# Altium schematic sheet cover.SchDoc: Cover
size A4; Organization: GPA Robotics; DocumentNumber: 1; SheetNumber: 1; SheetTotal: 4
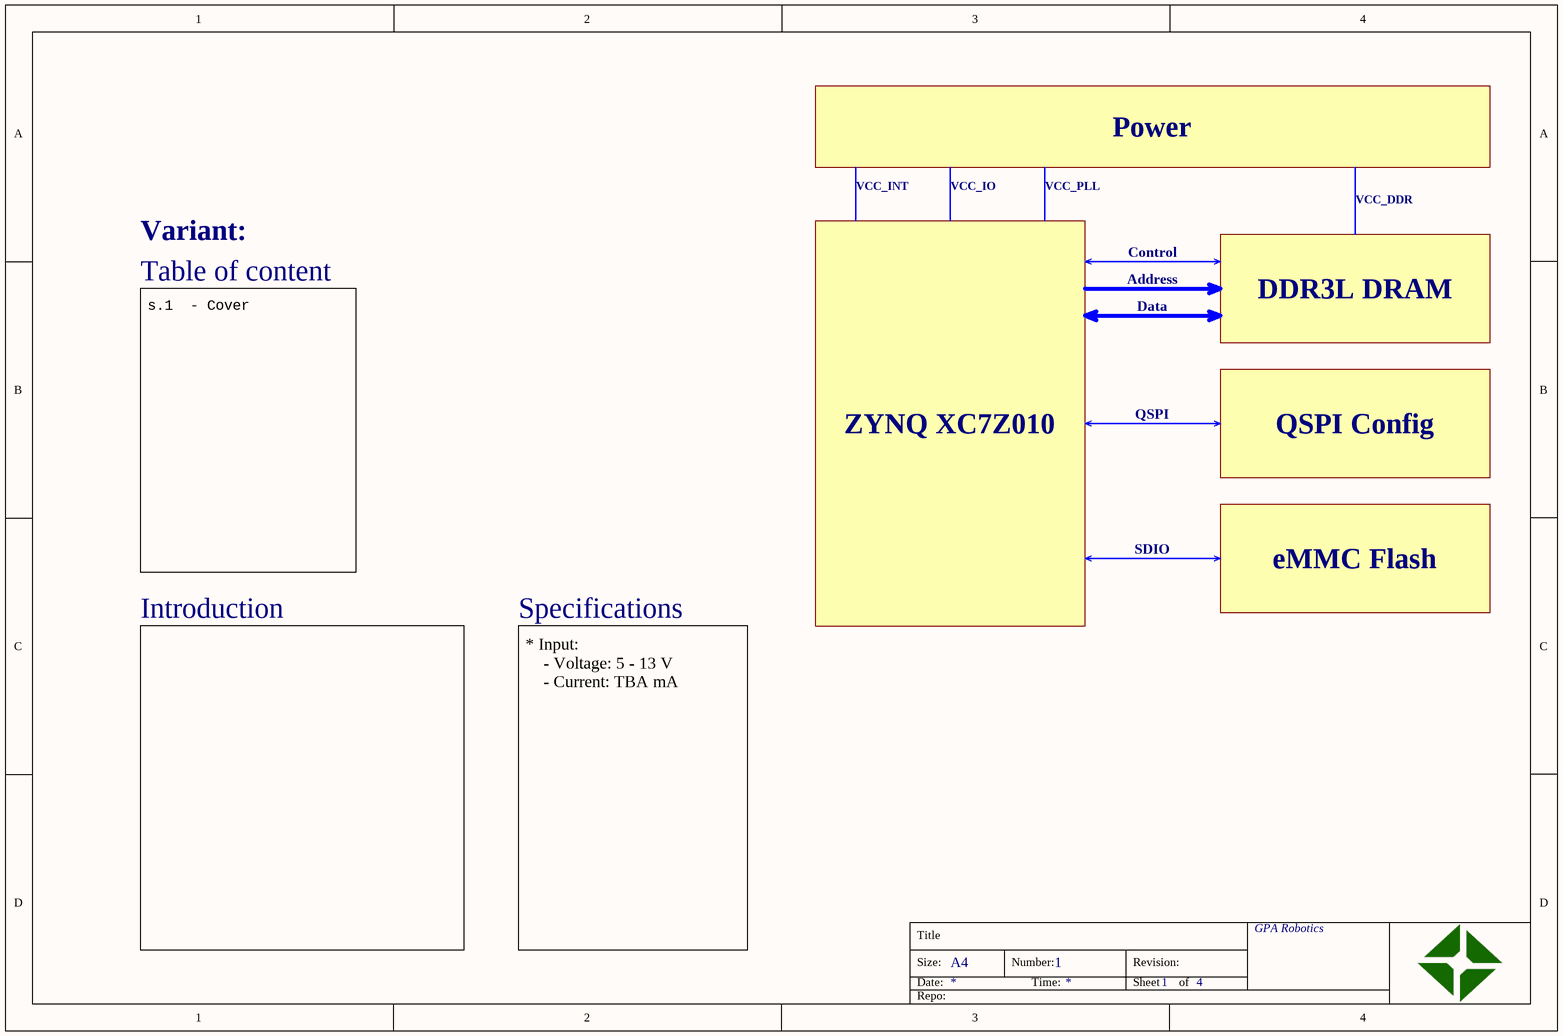
[diagram p0: cover.SchDoc]

## Notes on the sheet
- Power
- VCC_INT
- VCC_IO
- VCC_PLL
- VCC_DDR
- Table of content
- Control
- Address
- Data
- DDR3L DRAM
- ZYNQ XC7Z010
- QSPI
- QSPI Config
- s.1  - Cover
- SDIO
- eMMC Flash
- Introduction
- Specifications
- * Input:
  - Voltage: 5 - 13 V
  - Current: TBA mA
- Variant:
- Title
- Size:
- Date:
- A4
- Number:
- Time:
- Revision:
- Sheet
- of
- Repo: